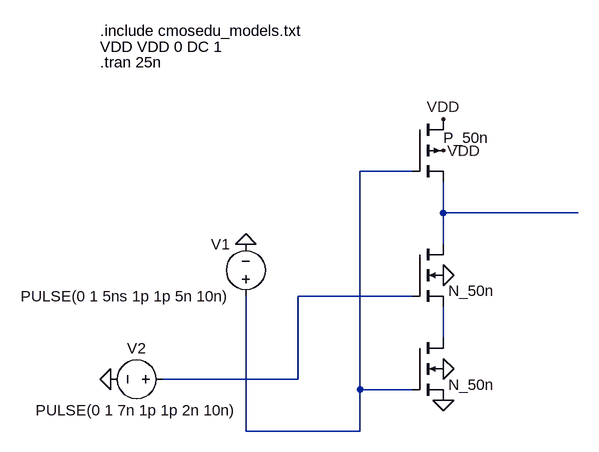
[diagram p0: schematic Ex2.asc]
Ex2.asc, the LTspice schematic file:
Version 4
SHEET 1 1560 680
WIRE 400 -128 320 -128
WIRE 448 -64 448 -112
WIRE 656 -64 448 -64
WIRE 448 -16 448 -64
WIRE 400 64 224 64
WIRE 448 128 448 80
WIRE 224 192 224 64
WIRE 224 192 16 192
WIRE 320 208 320 -128
WIRE 400 208 320 208
WIRE 144 272 144 64
WIRE 320 272 320 208
WIRE 320 272 144 272
FLAG 448 -208 VDD
FLAG 448 -160 VDD
FLAG 448 176 0
FLAG 448 224 0
FLAG 448 32 0
FLAG 144 -16 0
FLAG -64 192 0
SYMBOL nmos4 400 128 R0
WINDOW 0 56 32 Invisible 2
SYMATTR InstName M1
SYMATTR Value N_50n
SYMATTR Value2 l=50n w=1u
SYMBOL pmos4 400 -208 R0
WINDOW 0 56 32 Invisible 2
WINDOW 3 48 28 Left 2
SYMATTR InstName M2
SYMATTR Value P_50n
SYMATTR Value2 l=50n w=1u
SYMBOL nmos4 400 -16 R0
WINDOW 0 56 32 Invisible 2
SYMATTR InstName M3
SYMATTR Value N_50n
SYMATTR Value2 l=50n w=1u
SYMBOL voltage 144 80 R180
WINDOW 0 24 96 Left 2
WINDOW 3 24 16 Left 2
WINDOW 123 0 0 Left 0
WINDOW 39 0 0 Left 0
SYMATTR InstName V1
SYMATTR Value PULSE(0 1 5ns 1p 1p 5n 10n)
SYMBOL voltage 32 192 R90
WINDOW 0 -32 56 VBottom 2
WINDOW 3 32 56 VTop 2
WINDOW 123 0 0 Left 0
WINDOW 39 0 0 Left 0
SYMATTR InstName V2
SYMATTR Value PULSE(0 1 7n 1p 1p 2n 10n)
TEXT -80 -344 Left 2 !.include cmosedu_models.txt
TEXT -80 -320 Left 2 !VDD VDD 0 DC 1
TEXT -80 -296 Left 2 !.tran 25n

The netlist it stands for:
* Ex2.asc
M1 N004 N001 0 0 N_50n l=50n w=1u
M2 VDD N001 N002 VDD P_50n l=50n w=1u
M3 N002 N003 N004 0 N_50n l=50n w=1u
V1 N001 0 PULSE(0 1 5ns 1p 1p 5n 10n)
V2 N003 0 PULSE(0 1 7n 1p 1p 2n 10n)
.model NMOS NMOS
.model PMOS PMOS
.lib standard.mos
.include cmosedu_models.txt
VDD VDD 0 DC 1
.tran 25n
.backanno
.end